# Altium schematic sheet OBCComms.SchDoc
size 274 x 210 mm
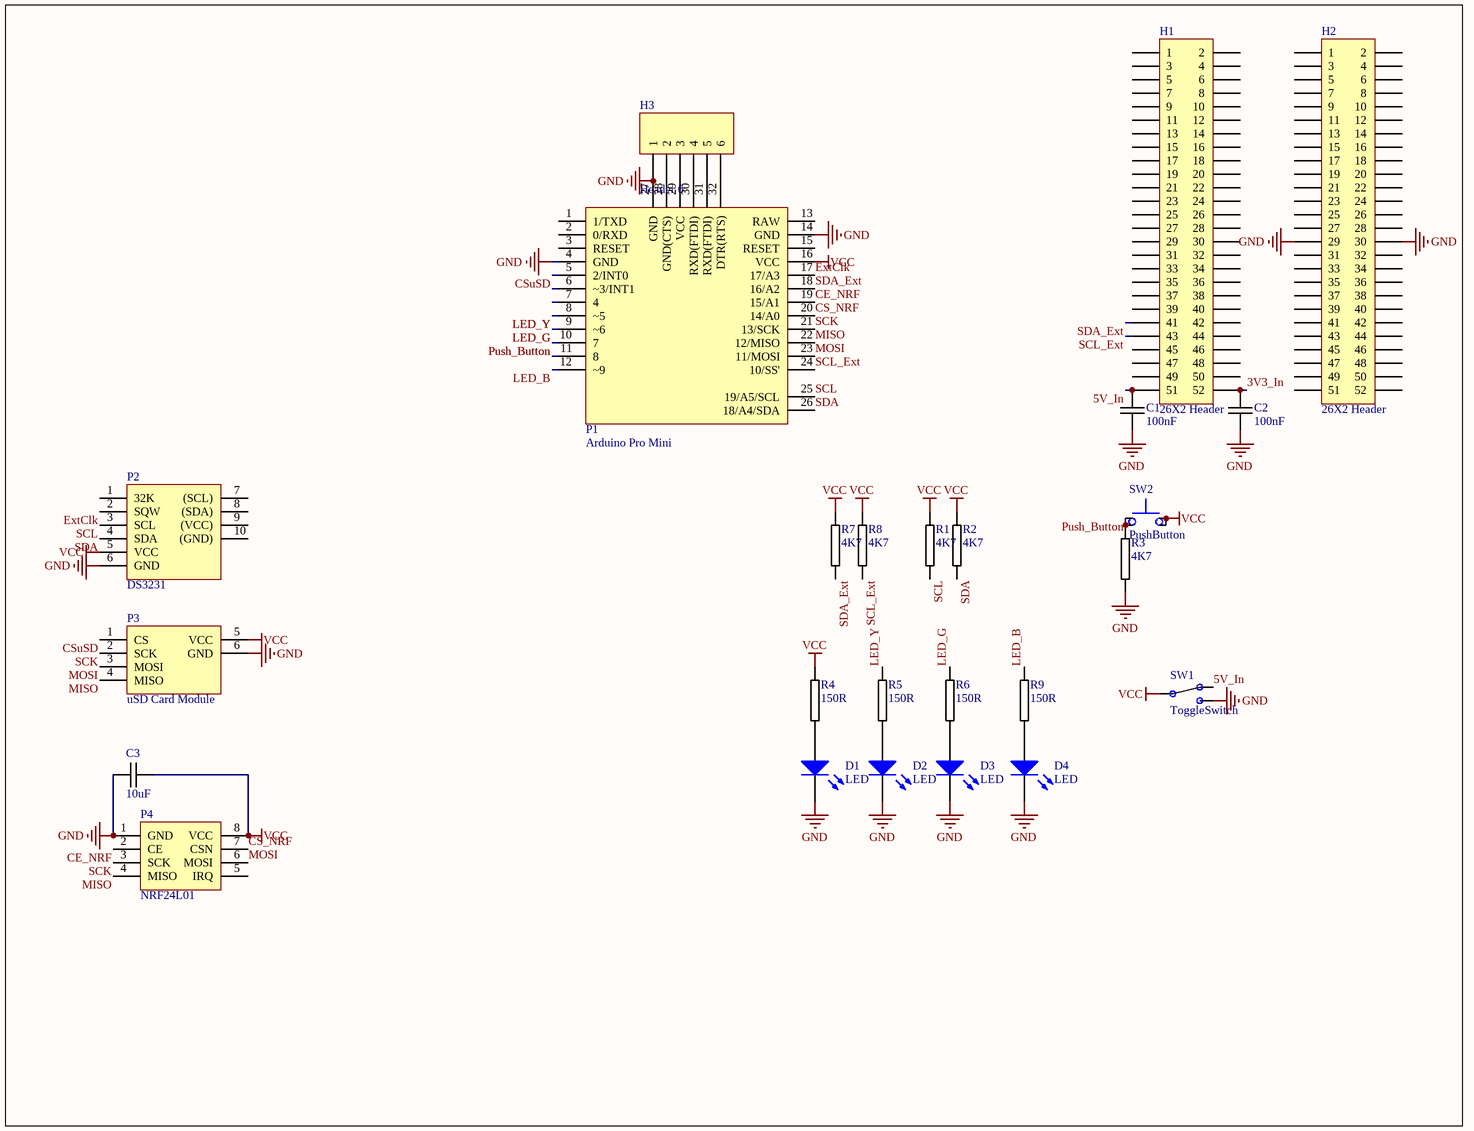
[diagram p0: OBCComms.SchDoc]

## Parts
C1  100nF  [0805C-TBD]
C2  100nF  [0805C-TBD]
C3  10uF  [0805C-GENERIC]
D1  LED  [LED]
D2  LED  [LED]
D3  LED  [LED]
D4  LED  [LED]
H1  26X2 Header  [26X2 Header]
H2  26X2 Header  [26X2 Header]
H3  Header 6  [HDR1X6]
P1  Arduino Pro Mini  [Arduino Pro Mini]
P2  DS3231  [RTC]
P3  uSD Card Module  [uSD Card Module]
P4  NRF24L01  [NRF24L01]
R1  4K7  [0805R-4K7]
R2  4K7  [0805R-4K7]
R3  4K7  [0805R-4K7]
R4  150R  [0805R-150]
R5  150R  [0805R-150]
R6  150R  [0805R-150]
R7  4K7  [0805R-4K7]
R8  4K7  [0805R-4K7]
R9  150R  [0805R-150]
SW1  ToggleSwitch  [SWITCHFOOTPRINT]
SW2  PushButton  [PushButton]

## Nets
GND: C1.2 C2.2 C3.1 D1.2(K) D2.2(K) D3.2(K) D4.2(K) H2.29 H2.30 H3.1 P1.4(GND) P1.14(GND) P1.27(GND) P2.6(GND) P3.6(GND) P4.1(GND) R3.2 SW1.25
VCC: C3.2 P1.16(VCC) P2.5(VCC) P3.5(VCC) P4.8(VCC) R1.1 R2.1 R4.1 R7.1 R8.1 SW1.23 SW2.27 SW2.29
3V3_In: C2.1 H1.52
5V_In: C1.1 H1.51 SW1.24
CE_NRF: P1.19(15/A1) P4.2(CE)
CS_NRF: P1.20(14/A0) P4.7(CSN)
CSuSD: P1.5(2/INT0) P3.1(CS)
ExtClk: P1.17(17/A3) P2.2(SQW)
LED_B: P1.12(~9) R9.1
LED_G: P1.9(~6) R6.1
LED_Y: P1.8(~5) R5.1
MISO: P1.22(12/MISO) P3.4(MISO) P4.4(MISO)
MOSI: P1.23(11/MOSI) P3.3(MOSI) P4.6(MOSI)
Push_Button: P1.10(7) R3.1 SW2.26 SW2.28
SCK: P1.21(13/SCK) P3.2(SCK) P4.3(SCK)
SCL: P1.25(19/A5/SCL) P2.3(SCL) R1.2
SCL_Ext: H1.43 P1.24(10/SS') R8.2
SDA: P1.26(18/A4/SDA) P2.4(SDA) R2.2
SDA_Ext: H1.41 P1.18(16/A2) R7.2
NetD1_1: D1.1(A) R4.2
NetD2_1: D2.1(A) R5.2
NetD3_1: D3.1(A) R6.2
NetD4_1: D4.1(A) R9.2
NetH3_2: H3.2 P1.28(GND(CTS))
NetH3_3: H3.3 P1.29(VCC)
NetH3_4: H3.4 P1.30(RXD(FTDI))
NetH3_5: H3.5 P1.31(RXD(FTDI))
NetH3_6: H3.6 P1.32(DTR(RTS))

Not connected (* = marked no-connect by the designer): H1 1 2 3 4 5 6 7 8 9 10 11 12 13 14 15 16 17 18 19 20 21 22 23 24 25 26 27 28 29 30 31 32 33 34 35 36 37 38 39 40 42 44 45 46 47 48 49 50; H2 1 2 3 4 5 6 7 8 9 10 11 12 13 14 15 16 17 18 19 20 21 22 23 24 25 26 27 28 31 32 33 34 35 36 37 38 39 40 41 42 43 44 45 46 47 48 49 50 51 52; P1 1(1/TXD) 2(0/RXD) 3(RESET) 6(~3/INT1) 7(4) 11(8) 13(RAW) 15(RESET); P2 1(32K) 7((SCL)) 8((SDA)) 9((VCC)) 10((GND)); P4 5(IRQ)

## Library data of the parts
C1 C2 = 0805C-100nF-25V-X7R-MUR: CAPACITOR 0805 CERAMIC; Supplier 1: Digi-Key; Supplier Part Number 1: 490-1673-1-ND
C3 = 0805C-10UF-16V-X5R-TDK: CAPACITOR 0805 CERAMIC; Manufacturer Part Number: C2012X5R1C106M; Manufacturer: TDK Corporation; REEL: C63; Supplier 1: Digi-Key; Supplier Part Number 1: 445-4115-2-ND
D1-D4 = LED: Small LED
H3 = Header 6: Header, 6-Pin; LatestRevisionDate: 17-Jul-2002; LatestRevisionNote: Re-released for DXP Platform.; Publisher: Altium Limited
P2 = DS3231: RTC
P4 = NRF24L01: Radio Transceiver
R1-R3 R7 R8 = 0805R-4K7: RESISTOR 0805 1/4 WATT THIN FILM; Reel: *
R4-R6 R9 = 0805R-150: RESISTOR 0805 1/4 WATT THIN FILM; Reel: *
SW1 = ToggleSwitch: pin to pad: 23>3 24>2 25>4
SW2 = PushButton: pin to pad: 26>5 27>7 28>6 29>8